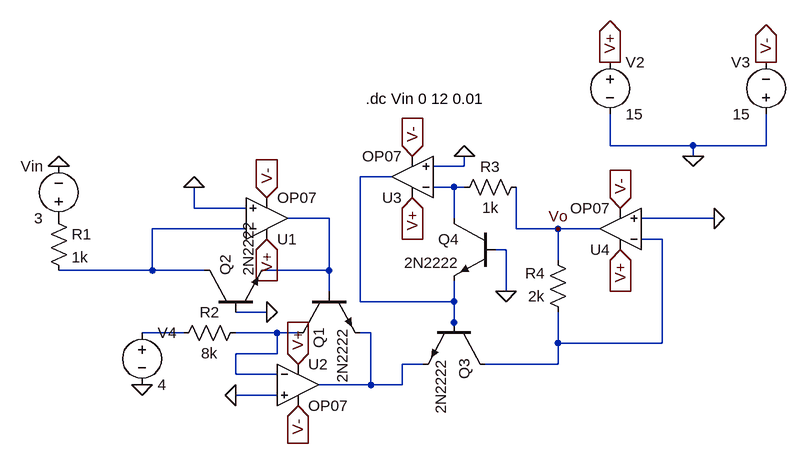
[diagram p0: schematic Squareroot_LTSpice.asc]
Squareroot_LTSpice.asc, the LTspice schematic file:
Version 4
SHEET 1 1048 680
WIRE 528 176 528 128
WIRE 656 176 528 176
WIRE 768 176 768 128
WIRE 768 176 656 176
WIRE 656 192 656 176
WIRE 304 208 304 192
WIRE 304 208 256 208
WIRE 192 224 144 224
WIRE 288 240 256 240
WIRE 304 240 288 240
WIRE -112 272 -112 240
WIRE -32 272 -112 272
WIRE 96 288 32 288
WIRE 288 288 288 240
WIRE 688 288 576 288
WIRE -32 304 -176 304
WIRE 384 304 384 240
WIRE 448 304 384 304
WIRE 512 304 448 304
WIRE 608 320 576 320
WIRE 368 336 352 336
WIRE 448 352 448 304
WIRE -176 368 -176 304
WIRE -176 368 -320 368
WIRE -96 368 -176 368
WIRE 96 368 96 288
WIRE 96 368 0 368
WIRE 96 400 96 368
WIRE 368 400 368 336
WIRE 144 416 144 224
WIRE 288 416 288 384
WIRE 288 416 144 416
WIRE 0 432 -48 432
WIRE 288 448 288 416
WIRE -128 464 -192 464
WIRE 16 464 -48 464
WIRE 48 464 16 464
WIRE 160 464 144 464
WIRE 288 464 288 448
WIRE 448 480 448 432
WIRE 608 480 608 320
WIRE 608 480 448 480
WIRE 16 496 16 464
WIRE 16 496 -48 496
WIRE 240 512 208 512
WIRE 448 512 448 480
WIRE 448 512 336 512
WIRE -48 528 -48 496
WIRE 16 528 -48 528
WIRE 160 544 160 464
WIRE 160 544 80 544
WIRE 208 544 208 512
WIRE 208 544 160 544
WIRE 16 560 -48 560
FLAG 368 400 0
FLAG 0 432 0
FLAG -48 560 0
FLAG 528 48 V+
IOPIN 528 48 Out
FLAG 768 48 V-
IOPIN 768 48 Out
FLAG 544 336 V+
IOPIN 544 336 In
FLAG 224 192 V-
IOPIN 224 192 In
FLAG 0 256 V-
IOPIN 0 256 In
FLAG 48 576 V-
IOPIN 48 576 In
FLAG 544 272 V-
IOPIN 544 272 In
FLAG 0 320 V+
IOPIN 0 320 In
FLAG 48 512 V+
IOPIN 48 512 In
FLAG 224 256 V+
IOPIN 224 256 In
FLAG -320 208 0
FLAG -192 544 0
FLAG 448 304 Vo
FLAG 304 192 0
FLAG -112 240 0
FLAG 688 288 0
FLAG 656 192 0
SYMBOL OP07 48 480 R0
SYMATTR InstName U2
SYMBOL OP07 544 368 R180
SYMATTR InstName U4
SYMBOL npn2 48 400 M90
SYMATTR InstName Q1
SYMATTR Value 2N2222
SYMBOL npn2 352 288 M0
SYMATTR InstName Q4
SYMATTR Value 2N2222
SYMBOL OP07 0 352 M180
SYMATTR InstName U1
SYMBOL npn -96 432 R270
SYMATTR InstName Q2
SYMATTR Value 2N2222
SYMBOL res -336 272 R0
SYMATTR InstName R1
SYMATTR Value 1k
SYMBOL res -32 448 R90
WINDOW 0 0 56 VBottom 2
WINDOW 3 32 56 VTop 2
SYMATTR InstName R2
SYMATTR Value 8k
SYMBOL res 400 224 R90
WINDOW 0 0 56 VBottom 2
WINDOW 3 32 56 VTop 2
SYMATTR InstName R3
SYMATTR Value 1k
SYMBOL res 464 448 R180
WINDOW 0 36 76 Left 2
WINDOW 3 36 40 Left 2
SYMATTR InstName R4
SYMATTR Value 2k
SYMBOL voltage -320 304 R180
WINDOW 0 24 96 Left 2
WINDOW 3 24 16 Left 2
WINDOW 123 0 0 Left 0
WINDOW 39 0 0 Left 0
SYMATTR InstName Vin
SYMATTR Value 3
SYMBOL voltage 528 32 R0
WINDOW 123 0 0 Left 0
WINDOW 39 0 0 Left 0
SYMATTR InstName V2
SYMATTR Value 15
SYMBOL voltage 768 144 R180
WINDOW 0 24 96 Left 2
WINDOW 3 24 16 Left 2
WINDOW 123 0 0 Left 0
WINDOW 39 0 0 Left 0
SYMATTR InstName V3
SYMATTR Value 15
SYMBOL OP07 224 288 R180
SYMATTR InstName U3
SYMBOL voltage -192 448 R0
WINDOW 123 0 0 Left 0
WINDOW 39 0 0 Left 0
SYMATTR InstName V4
SYMATTR Value 4
SYMBOL npn 336 448 R90
SYMATTR InstName Q3
SYMATTR Value 2N2222
TEXT 152 104 Left 2 !.dc Vin 0 12 0.01

The netlist it stands for:
* Squareroot_LTSpice.asc
XU2 0 N007 V+ V- N008 LT1001  ; OP07, pins In+ In- V+ V- OUT
XU4 0 N005 V+ V- Vo LT1001  ; OP07, pins In+ In- V+ V- OUT
Q1 N007 N003 N008 0 2N2222
Q4 N002 0 N001 0 2N2222
XU1 0 N004 V+ V- N003 LT1001  ; OP07, pins In+ In- V+ V- OUT
Q2 N004 0 N003 0 2N2222
R1 P001 N004 1k
R2 N007 N006 8k
R3 Vo N002 1k
R4 N005 Vo 2k
Vin P001 0 3
V2 V+ 0 15
V3 0 V- 15
XU3 0 N002 V+ V- N001 LT1001  ; OP07, pins In+ In- V+ V- OUT
V4 N006 0 4
Q3 N005 N001 N008 0 2N2222
.model NPN NPN
.model PNP PNP
.lib standard.bjt
.dc Vin 0 12 0.01
.lib LTC.lib
.backanno
.end